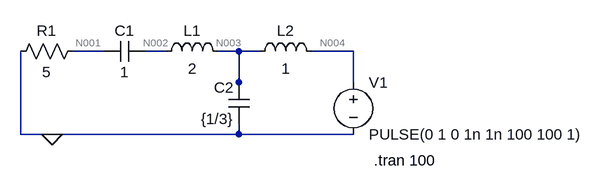
[diagram p0: schematic mehcanical_system.asc]
mehcanical_system.asc, the LTspice schematic file:
Version 4
SHEET 1 904 680
WIRE 144 128 96 128
WIRE 240 128 208 128
WIRE 352 128 320 128
WIRE 384 128 352 128
WIRE 528 128 464 128
WIRE 352 176 352 128
WIRE 528 176 528 128
WIRE 352 192 352 176
WIRE 16 256 16 128
WIRE 64 256 16 256
WIRE 352 256 352 240
WIRE 352 256 64 256
WIRE 528 256 352 256
FLAG 64 256 0
SYMBOL res 112 112 R90
WINDOW 0 0 56 VBottom 2
WINDOW 3 32 56 VTop 2
SYMATTR InstName R1
SYMATTR Value 5
SYMBOL cap 208 112 R90
WINDOW 0 0 32 VBottom 2
WINDOW 3 32 32 VTop 2
SYMATTR InstName C1
SYMATTR Value 1
SYMBOL cap 368 240 R180
WINDOW 0 24 56 Left 2
WINDOW 3 24 8 Left 2
SYMATTR InstName C2
SYMATTR Value {1/3}
SYMBOL ind 224 144 R270
WINDOW 0 32 56 VTop 2
WINDOW 3 5 56 VBottom 2
SYMATTR InstName L1
SYMATTR Value 2
SYMATTR SpiceLine Rser=0
SYMBOL ind 368 144 R270
WINDOW 0 32 56 VTop 2
WINDOW 3 5 56 VBottom 2
SYMATTR InstName L2
SYMATTR Value 1
SYMATTR SpiceLine Rser=0
SYMBOL voltage 528 160 R0
WINDOW 123 0 0 Left 0
WINDOW 39 0 0 Left 0
SYMATTR InstName V1
SYMATTR Value PULSE(0 1 0 1n 1n 100 100 1)
TEXT 560 296 Left 2 !.tran 100

The netlist it stands for:
* mehcanical_system.asc
R1 N001 0 5
C1 N002 N001 1
C2 0 N003 {1/3}
L1 N002 N003 2 Rser=0
L2 N003 N004 1 Rser=0
V1 N004 0 PULSE(0 1 0 1n 1n 100 100 1)
.tran 100
.backanno
.end

* Results of the author's LTspice run, read from the files saved beside the schematic
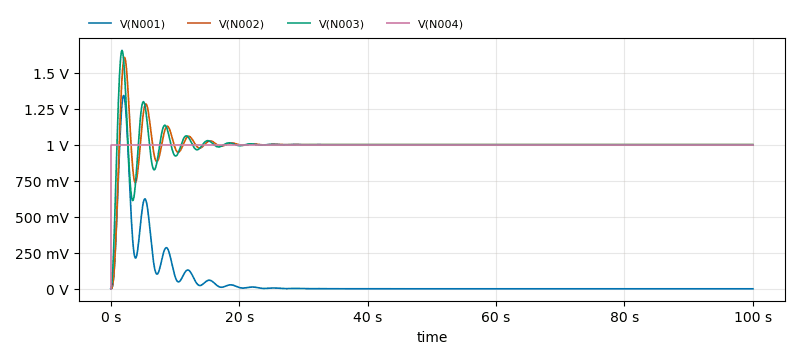
[diagram p1: Transient Analysis of mehcanical_system.asc, plotted from the saved traces]
* Transient Analysis, 1 run:
*   V(N001): min 0 V, max 1.341 V, average 49.99 mV, rms 182.4 mV, last 0 V
*   V(N002): min 0 V, max 1.606 V, average 1 V, rms 1.006 V, last 1 V
*   V(N003): min 0 V, max 1.654 V, average 1 V, rms 1.005 V, last 1 V
*   V(N004): min 0 V, max 1 V, average 1 V, rms 1 V, last 1 V